# Altium schematic sheet 05.Power Sequence_IO Domain Map.SchDoc
size 420 x 297 mm; Revision: V2.1; Schematic Page Number: 11; Page Number: 6; Check: Default; Schematic Name: RK_NVR_DEMO1_RK3588_LP4/4x_V21; Page Count: 43; Page name: 05.Power Sequence/IO Domain Map; Designer: Zhangdz; Schematic Page Count: 99; Revcode: V2.1; DsnPath: E:\Work\SBER\RK3588_SOM\temp\RK_NVR_DEMO1_RK3588_LP4XD200P232SD8_V21_20211228.DSN; SchematicName: RK_NVR_DEMO1_RK3588_LP4/4x_V21; PageName: 05.Power Sequence/IO Domain Map; PageSize: A3; TopSchematic: True
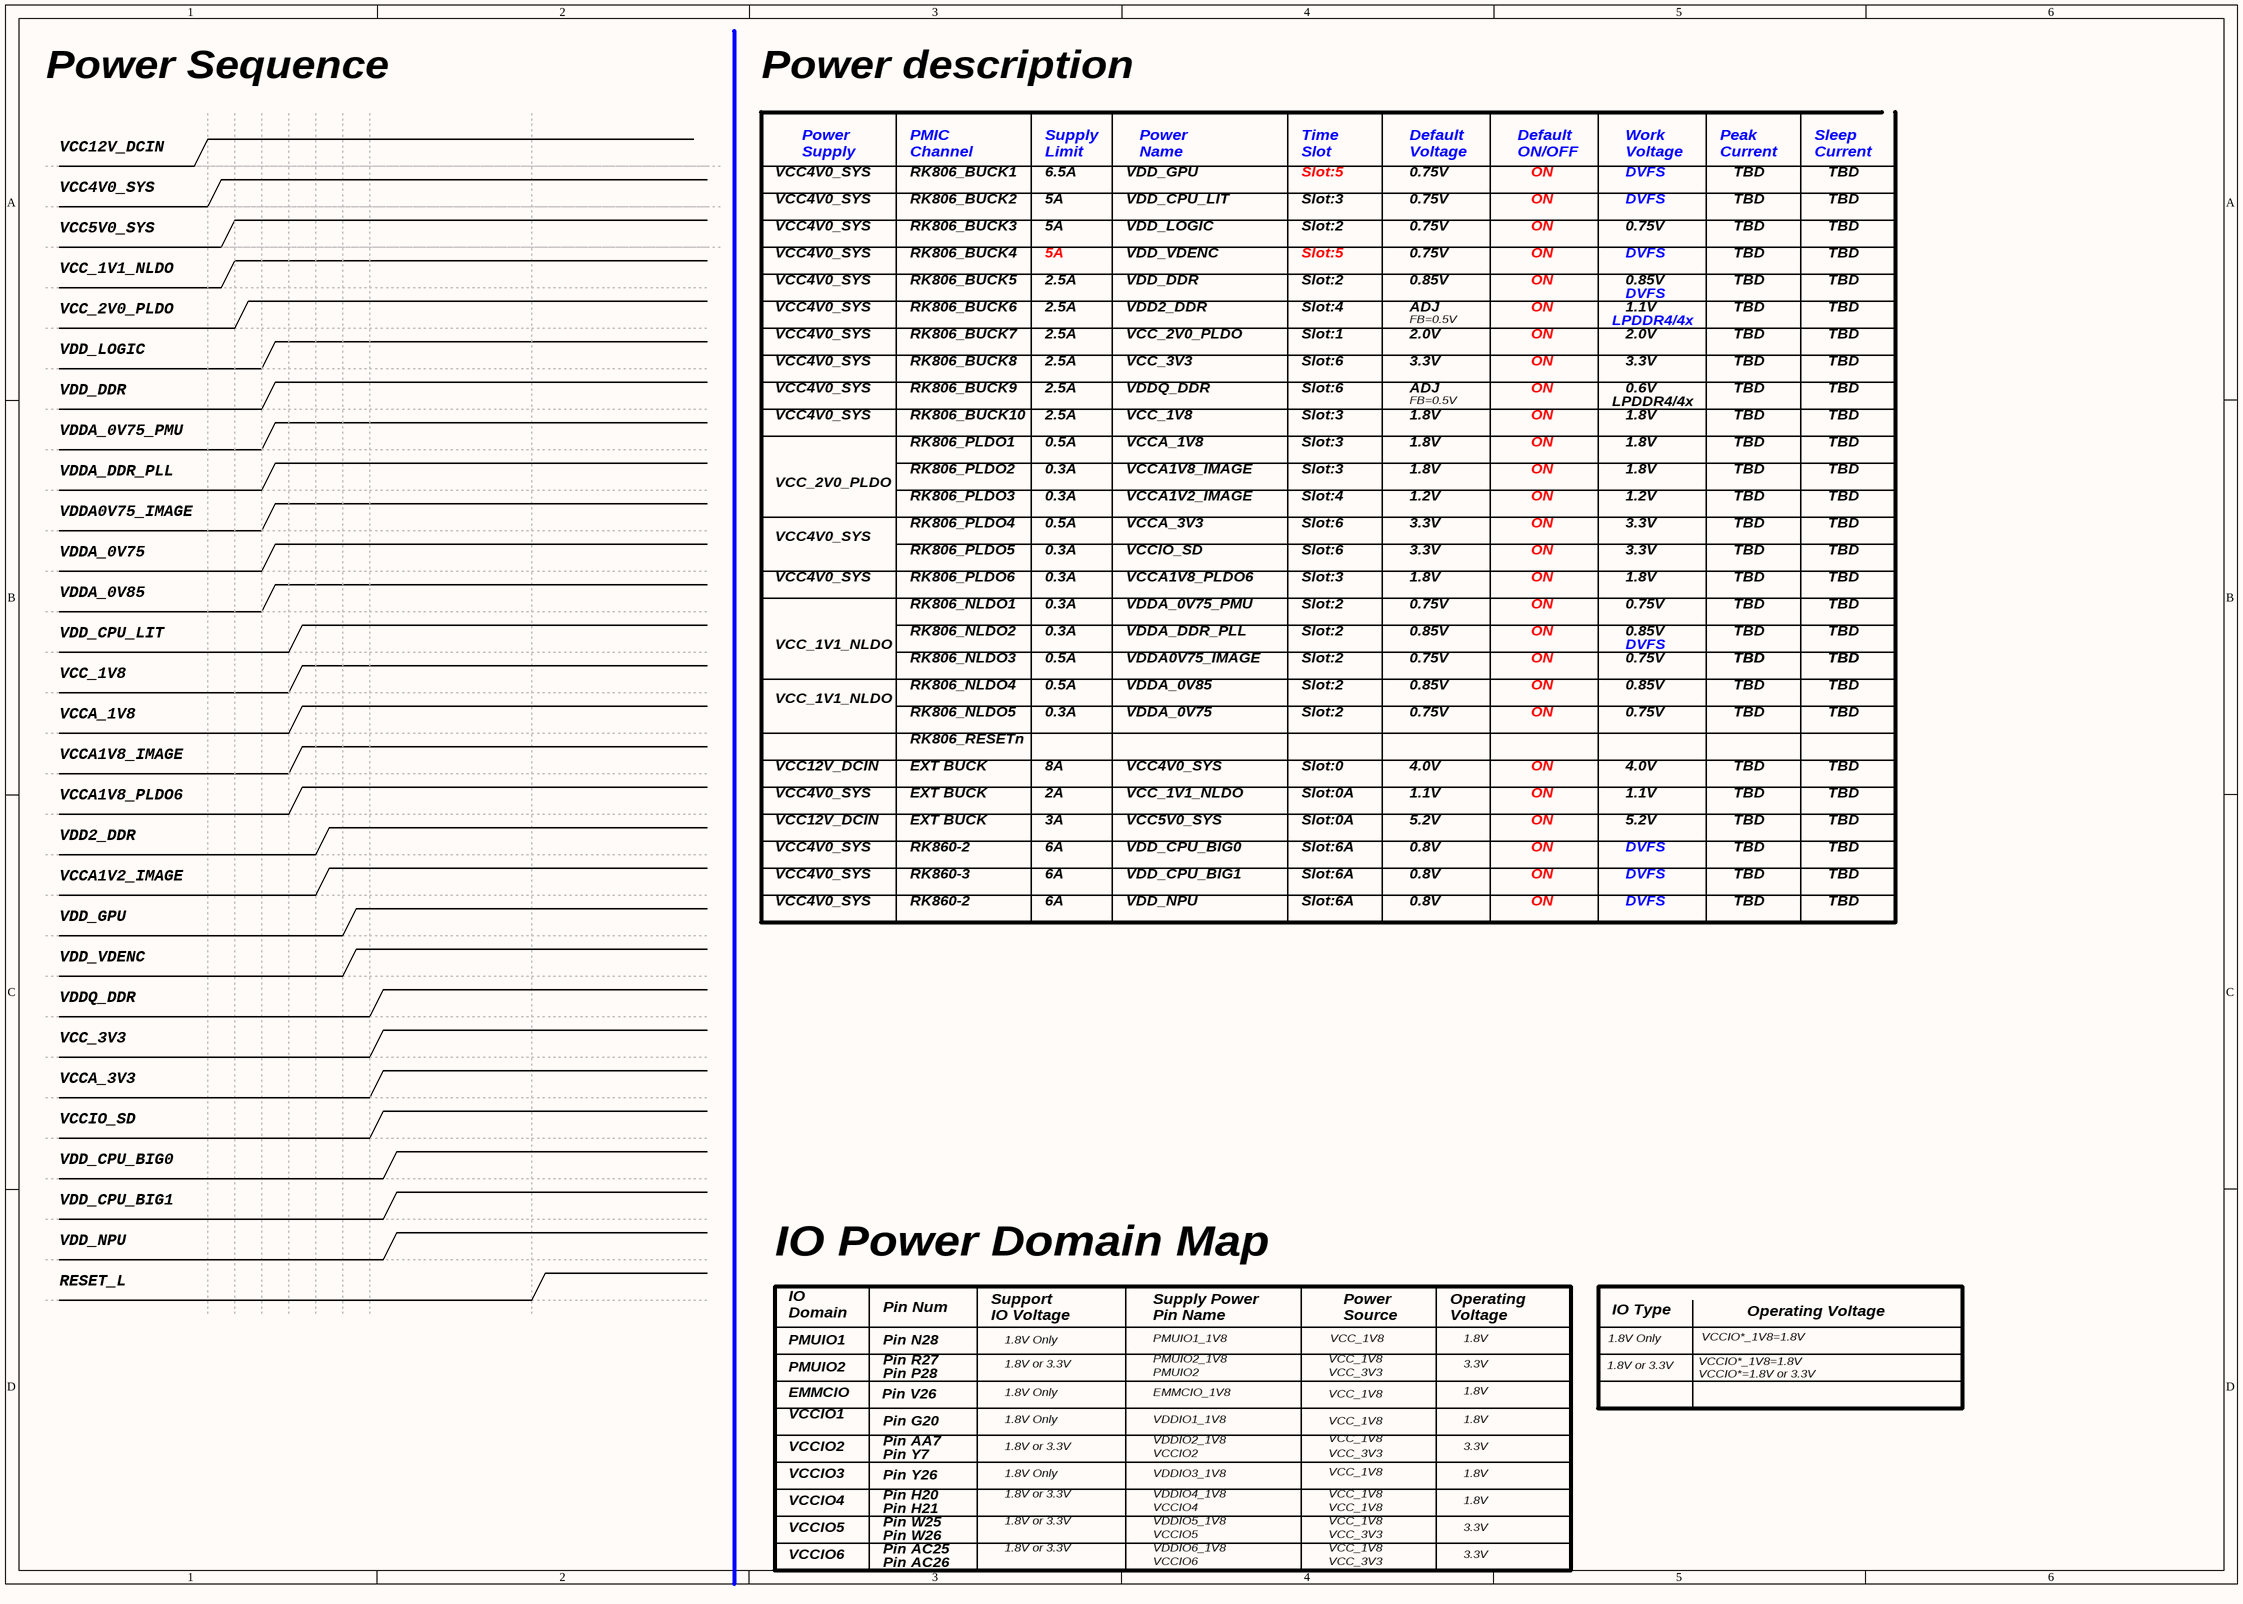
[diagram p0: 05.Power Sequence_IO Domain Map.SchDoc]

## Notes on the sheet
- Power Sequence
- Power description
- VCC4V0_SYS
- VCC12V_DCIN
- Power
  Supply
- PMIC
  Channel
- RK806_BUCK1
- Supply
  Limit
- 6.5A
- VDD_GPU
- Power
  Name
- Time
  Slot
- Slot:5
- Default
  Voltage
- 0.75V
- Default
  ON/OFF
- ON
- Work
  Voltage
- DVFS
- Peak
  Current
- TBD
- Sleep
  Current
- VCC5V0_SYS
- RK806_BUCK2
- RK806_BUCK3
- RK806_BUCK4
- 5A
- VDD_CPU_LIT
- VDD_LOGIC
- VDD_VDENC
- Slot:2
- Slot:3
- VCC_1V1_NLDO
- VCC_2V0_PLDO
- RK806_BUCK5
- RK806_BUCK6
- 2.5A
- VDD2_DDR
- VDD_DDR
- Slot:4
- 0.85V
- ADJ
- FB=0.5V
- LPDDR4/4x
- 1.1V
- RK806_BUCK7
- RK806_BUCK8
- RK806_BUCK9
- VCC_3V3
- VDDQ_DDR
- Slot:1
- Slot:6
- 2.0V
- 3.3V
- 0.6V
- VDDA_0V75_PMU
- RK806_BUCK10
- RK806_PLDO1
- 0.5A
- VCCA_1V8
- VCC_1V8
- 1.8V
- VDDA_DDR_PLL
- VDDA0V75_IMAGE
- RK806_PLDO2
- RK806_PLDO3
- RK806_PLDO4
- 0.3A
- VCCA1V2_IMAGE
- VCCA_3V3
- VCCA1V8_IMAGE
- 1.2V
- VDDA_0V75
- VDDA_0V85
- RK806_PLDO5
- RK806_PLDO6
- VCCA1V8_PLDO6
- VCCIO_SD
- RK806_NLDO3
- RK806_NLDO1
- RK806_NLDO2
- RK806_NLDO4
- RK806_NLDO5
- RK806_RESETn
- EXT BUCK
- 8A
- 2A
- Slot:0
- Slot:0A
- 4.0V
- RK860-2
- 3A
- 6A
- VDD_CPU_BIG0
- Slot:6A
- 5.2V
- 0.8V
- RK860-3
- VDD_CPU_BIG1
- VDD_NPU
- IO Power Domain Map
- RESET_L
- IO
  Domain
- Pin Num
- Support
  IO Voltage
- 1.8V Only
- Supply Power
  Pin Name
- PMUIO1_1V8
- Power
  Source
- Operating
  Voltage
- IO Type
- VCCIO*_1V8=1.8V
- Operating Voltage
- PMUIO1
- PMUIO2
- EMMCIO
- Pin V26
- Pin N28
- Pin R27
- Pin P28
- 1.8V or 3.3V
- PMUIO2_1V8
- EMMCIO_1V8
- VCCIO*_1V8=1.8V
  VCCIO*=1.8V or 3.3V
- VCCIO1
- VCCIO2
- VCCIO3
- Pin Y7
- Pin AA7
- Pin G20
- VDDIO1_1V8
- VDDIO2_1V8
- VDDIO3_1V8
- VCCIO4
- VCCIO5
- Pin Y26
- Pin H20
- Pin H21
- Pin W25
- Pin W26
- VDDIO4_1V8
- VDDIO5_1V8
- VCCIO6
- Pin AC25
- Pin AC26
- VDDIO6_1V8